# Altium schematic sheet USB_CONNS.SchDoc
size A4; DrawnBy: UGUR KELES; SheetNumber: 4; SheetTotal: 4; Size: A4
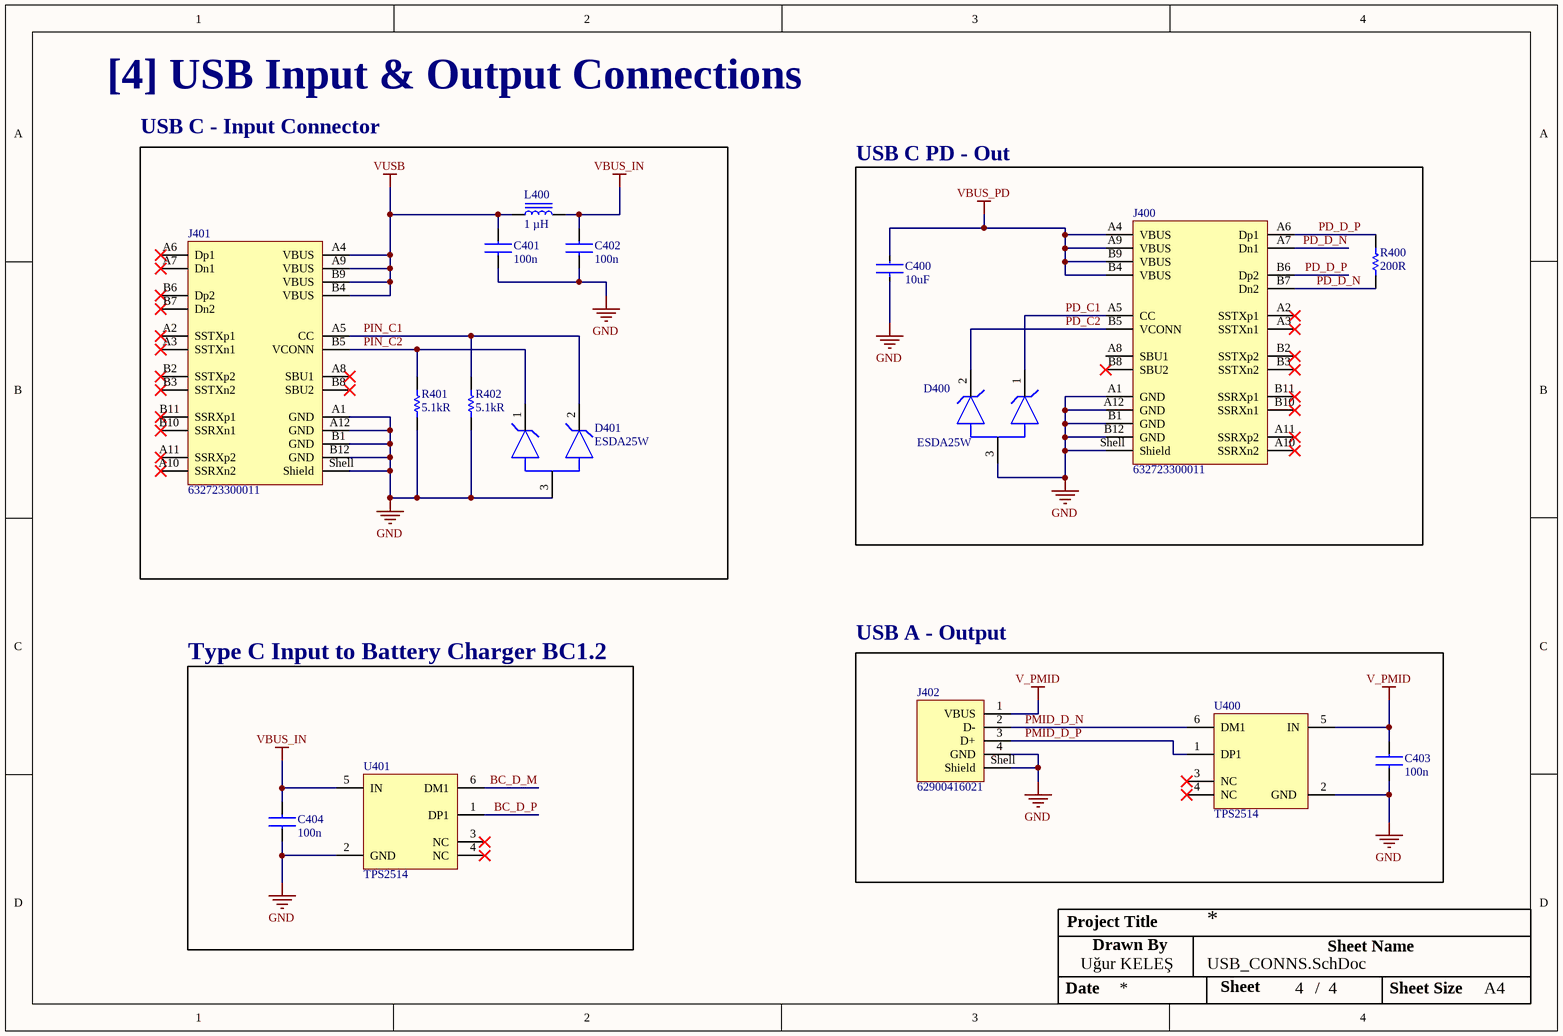
[diagram p0: USB_CONNS.SchDoc]

## Parts
C400  Capacitance: 10uF  [FP-GRT31C-0_2-IPC_A]  (hidden comment: GRT31CR61H106ME01L)
C401  100n  [CAP CER 0402]
C402  100n  [CAP CER 0402]
C403  100n  [CAP CER 0402]
C404  100n  [CAP CER 0402]
D400  ESDA25W  [FP-SOT323-3L-IPC_C]
D401  ESDA25W  [FP-SOT323-3L-IPC_C]
J400  632723300011  [632723300011]
J401  632723300011  [632723300011]
J402  62900416021  [62900416021]
L400  1 µH  [TDK MLZ1608]
R400  value 200R  [RESC1005X40X25ML05T05]  (hidden comment: CRCW0402200RJNED)
R401  value 5.1kR  [RESC1005X40X25NL05T10]  (hidden comment: RC0402FR-075K1L)
R402  value 5.1kR  [RESC1005X40X25NL05T10]  (hidden comment: RC0402FR-075K1L)
U400  TPS2514  [SOT23-6L]
U401  TPS2514  [SOT23-6L]

## Blocks framed on the sheet
USB C - Input Connector: C401 C402 D401 J401 L400 R401 R402
USB C PD - Out: C400 D400 J400 R400
Type C Input to Battery Charger BC1.2: C404 U401
USB A - Output: C403 J402 U400

## Nets
GND: C400.1 C401.1 C402.1 C403.1 C404.1 D400.3(COMMON_ANODE) D401.3(COMMON_ANODE) J400.A1(GND) J400.A12(GND) J400.B1(GND) J400.B12(GND) J400.Shell(Shield) J401.A1(GND) J401.A12(GND) J401.B1(GND) J401.B12(GND) J401.Shell(Shield) J402.4(GND) J402.Shell(Shield) R401.2 R402.2 U400.2(GND) U401.2(GND)
V_PMID: C403.2 J402.1(VBUS) U400.5(IN)
VBUS_IN: C402.2 C404.2 L400.2 U401.5(IN)
VBUS_PD: C400.2 J400.A4(VBUS) J400.A9(VBUS) J400.B4(VBUS) J400.B9(VBUS)
VUSB: C401.2 J401.A4(VBUS) J401.A9(VBUS) J401.B4(VBUS) J401.B9(VBUS) L400.1
BC_D_M: U401.6(DM1)
BC_D_P: U401.1(DP1)
PD_C1: D400.1(1_CATHODE) J400.A5(CC)
PD_C2: D400.2(2_CATHODE) J400.B5(VCONN)
PD_D_N: J400.A7(Dn1) J400.B7(Dn2) R400.1
PD_D_P: J400.A6(Dp1) J400.B6(Dp2) R400.2
PIN_C1: D401.2(2_CATHODE) J401.A5(CC) R402.1
PIN_C2: D401.1(1_CATHODE) J401.B5(VCONN) R401.1
PMID_D_N: J402.2(D-) U400.6(DM1)
PMID_D_P: J402.3(D+) U400.1(DP1)

Not connected (* = marked no-connect by the designer): J400 A2(SSTXp1)* A3(SSTXn1)* A8(SBU1) A10(SSRXn2)* A11(SSRXp2)* B2(SSTXp2)* B3(SSTXn2)* B8(SBU2)* B10(SSRXn1)* B11(SSRXp1)*; J401 A2(SSTXp1)* A3(SSTXn1)* A6(Dp1)* A7(Dn1)* A8(SBU1)* A10(SSRXn2)* A11(SSRXp2)* B2(SSTXp2)* B3(SSTXn2)* B6(Dp2)* B7(Dn2)* B8(SBU2)* B10(SSRXn1)* B11(SSRXp1)*; U400 3(NC)* 4(NC)*; U401 3(NC)* 4(NC)*

## Notes on the sheet
- [4] USB Input & Output Connections
- Project Title
- Uğur KELEŞ
- Drawn By
- Sheet Name
- Date
- Sheet
- /
- Sheet Size

## Library data of the parts
C400 = CMP-06035-048951-1: CAP CER 10UF 50V X5R 1206; Tolerance: 20%; Length: 0.126inch; Mount: Surface Mount; Packaging: Tape and Reel; Case/Package: 1206; Case Code (Imperial): 1206; Max Operating Temperature: 85°C; Voltage Rating: 50V; Ratings: AEC-Q200; Min Operating Temperature: -55°C; Thickness: 0.071inch; Width: 0.063inch; Case Code (Metric): 3216
C401-C404 = CAP CER GENERIC 0402: Designed by: UK; Value: 100n
D400 D401 = CMP-12225-000065-1: TVS DIODE 24VWM SOT323; Number of Elements: 2; Leakage Current: 1uA; Reverse Standoff Voltage: 24V; ESD Protection: Yes; Operating Supply Voltage: 1.2V; Peak Pulse Power: 400W; Test Current: 1mA; Power Line Protection: No; Breakdown Voltage: 25V; Direction: Unidirectional; Max Breakdown Voltage: 30V; Element Configuration: Common Anode; Diode Type: ZENER; Capacitance: 65pF; Depth: 1.25mm; Number of Channels: 2; Termination: SMD/SMT; Width: 1.25mm; Mount: Surface Mount; Working Voltage: 24V; Number of Pins: 3; RoHS Compliant: Yes; REACH SVHC: No SVHC; Max Power Dissipation: 400W; Number of Unidirectional Channels: 2; Radiation Hardening: No; Height: 1.1mm; Series: ESDA, TRANSIL™; Case/Package: SOT-323; Max Reverse Leakage Current: 1uA; Max Operating Temperature: 125°C; Lead Free: Lead Free; Resistor Type: Zener; Min Operating Temperature: -40°C; Voltage Rating (DC): 25V; Reverse Breakdown Voltage: 25V; Package Quantity: 1; Min Breakdown Voltage: 25V; Polarity: Unidirectional; Packaging: Tape and Reel; Length: 2mm
J400 J401 = CMP-1502-03214-3: NexarPartId: 68112675; Pin Length: 1.9mm; Current Rating: 5A; Gender: Receptacle; Voltage Rating: 20V; Number of Contacts: 24; Insulation Resistance: 1GΩ; USB Standard: USB 3.1; Connector Type: USB; Contact Resistance: 30mΩ; Min Operating Temperature: -40°C; Mount: Surface Mount, Through Hole; Height: 3.21mm; Number of Pins: 24; RoHS: Compliant; Orientation: Horizontal; Max Operating Temperature: 105°C; Packaging: Tape and Reel; Contact Material: Gold, Nickel
J402 = CMP-1502-03240-2: NexarPartId: 19991170; Number of Contacts: 4; Insulation Resistance: 1GΩ; Connector Type: USB; Contact Resistance: 20mΩ; Gender: Receptacle; Current Rating: 1.5A; Operating Supply Voltage: 30V; USB Standard: USB 2.0; Packaging: Cut Tape; Contact Plating: Gold; REACH SVHC: Unknown; Orientation: Horizontal; RoHS: Compliant; Features: Shielded; Length: 14.4mm; Max Operating Temperature: 105°C; Number of Pins: 4; Termination: SMD/SMT; Lead Free: Lead Free; Min Operating Temperature: -40°C; Mount: Horizontal, Surface Mount
L400 = MLZ1608N1R0LT000: FIXED IND 1UH 700MA 110 MOHM SMD; Manufacturer: TDK Corporation; Current - Saturation: 140mA; Frequency - Self Resonant: 170MHz; Inductance Frequency - Test: 2 MHz; Material - Core: Ferrite; Shielding: Shielded; Tolerance: ±20%; Type: Multilayer; Part Number: MLZ1608N1R0LT000; ComponentLink1Description: Datasheet; ComponentLink1URL: https://product.tdk.com/info/en/catalog/datasheets/inductor_commercial_decoupling_mlz1608_en.pdf?ref_disty=digikey; ComponentLink2Description: DigiKey Link; ComponentLink2URL: https://www.digikey.com/en/products/detail/tdk-corporation/MLZ1608N1R0LT000/2523491; Current Rating (Amps): 700 mA; DC Resistance (DCR): 110mOhm; Device Package: 0603 (1608 Metric); Height - Seated (Max): 0.037" (0.95mm); Inductance: 1 µH; LastUpdated: 26-Jul-24 2:58:53 PM; Lifecycle Status: Active; Minimum Order: 1; Mounting Type: Surface Mount; Operating Temperature: -55°C ~ 125°C; Package / Case: 0603 (1608 Metric); Packaging: TapeAndReel; PartId: 8203; Part Status: Active; Price: 0.04; Series: MLZ; Size / Dimension: 0.063" L x 0.031" W (1.60mm x 0.80mm); Supplier 1: DigiKey; Supplier Part Number 1: 445-6753-1-ND; Supplier Device Package: 0603 (1608 Metric); Value: 1 µH
R400 = CMP-2002-08353-1: Manufacturer: Vishay Dale; Tolerance: 5%; Power: 63mW; Working Voltage: 50V; Temperature Coefficient (ppm/Cel): 200; Rated Temperature: 70°C; Package Height: 0.35mm; Package Length: 1mm; Package Width: 0.5mm; Reference Standard: AEC-Q200; Part Number: CRCW0402200RJNED; Supplier: Mouser; Supplier Part Number: 71-CRCW0402J-200-E3; Manufacturer Part Number: CRCW0402200RJNED; RoHS: Yes; Category: Chip SMD Resistors; Stock: 16278; Pricing: 1=0,1, 10=0,018, 50=0,018, 100=0,014, 1000=0,008, 10000=0,004 (USD); Mounting Technology: Surface Mount; Pins: 2; Case/Package: 0402; Terminal Finish: Nickel; Package Shape: Rectangular; Min Operating Temperature: -55°C; Max Operating Temperature: 155°C; JESD-609 Code: e3; Resistor Type: FIXED RESISTOR; Construction: Chip; Packaging: Tape and Reel; Technology: METAL GLAZE/THICK FILM; Termination: Wraparound; Reach SVHC Compliant: Yes; RoHS Compliant: Yes; ComponentLink1URL: https://datasheet.ciiva.com:443/pdfs/VipMasterIC/IC/VISH/VISH-S-A0007266705/VISH-S-A0007266705-1.pdf?src-supplier=IHS+Markit; ComponentLink1Description: https://datasheet.ciiva.com:443/pdfs/VipMasterIC/IC/VISH/VISH-S-A0007266705/VISH-S-A0007266705-1.pdf?src-supplier=IHS+Markit; ComponentLink2URL: https://datasheet.ciiva.com/3883/41394838s8306212n6892-3883398.pdf?src-supplier=Arrow+Electronics; ComponentLink2Description: https://datasheet.ciiva.com/3883/41394838s8306212n6892-3883398.pdf?src-supplier=Arrow+Electronics; ComponentLink3URL: https://datasheet.ciiva.com/26914/getdatasheetpartid-123864-26914679.pdf?src-supplier=Verical; ComponentLink3Description: https://datasheet.ciiva.com/26914/getdatasheetpartid-123864-26914679.pdf?src-supplier=Verical; ComponentLink4URL: https://datasheet.ciiva.com/28634/1847332-28634488.pdf?src-supplier=Element14; ComponentLink4Description: https://datasheet.ciiva.com/28634/1847332-28634488.pdf?src-supplier=Element14; ComponentLink5URL: https://datasheet.ciiva.com/46385/1807946-46385293.pdf?src-supplier=Element14; ComponentLink5Description: https://datasheet.ciiva.com/46385/1807946-46385293.pdf?src-supplier=Element14; ComponentLink6URL: https://datasheet.ciiva.com/2462/dcrcwe3-2462074.pdf?src-supplier=Digikey; ComponentLink6Description: https://datasheet.ciiva.com/2462/dcrcwe3-2462074.pdf?src-supplier=Digikey; ComponentLink7URL: https://datasheet.ciiva.com/2462/dcrcwe3-2462075.pdf?src-supplier=Digikey; ComponentLink7Description: https://datasheet.ciiva.com/2462/dcrcwe3-2462075.pdf?src-supplier=Digikey; ComponentLink8URL: https://datasheet.ciiva.com/2462/dcrcwe3-2462073.pdf?src-supplier=Digikey; ComponentLink8Description: https://datasheet.ciiva.com/2462/dcrcwe3-2462073.pdf?src-supplier=Digikey; ComponentLink9URL: https://datasheet.ciiva.com/16759/70201119-16759061.pdf?src-supplier=Allied+Electronics; ComponentLink9Description: https://datasheet.ciiva.com/16759/70201119-16759061.pdf?src-supplier=Allied+Electronics; ComponentLink10URL: https://datasheet.ciiva.com/22869/70201119-22869423.pdf?src-supplier=Allied+Electronics; ComponentLink10Description: https://datasheet.ciiva.com/22869/70201119-22869423.pdf?src-supplier=Allied+Electronics; ComponentLink11URL: https://datasheet.ciiva.com/8336/dcrcwe3-8336649.pdf?src-supplier=Avnet; ComponentLink11Description: https://datasheet.ciiva.com/8336/dcrcwe3-8336649.pdf?src-supplier=Avnet; ComponentLink12URL: https://datasheet.ciiva.com/16394/dcrcwe3-16394457.pdf?src-supplier=Future+Electronics; ComponentLink12Description: https://datasheet.ciiva.com/16394/dcrcwe3-16394457.pdf?src-supplier=Future+Electronics
R401 R402 = CMP-2002-07753-1: Manufacturer: Yageo / Phycomp; Tolerance: 1%; Power: 62.5mW; Rated Temperature: 70°C; Working Voltage: 50V; Temperature Coefficient (ppm/Cel): 100; Additional Feature: LASER TRIMMABLE; Package Height: 0.35mm; Package Length: 1mm; Package Width: 0.5mm; Part Number: RC0402FR-075K1L; Supplier: Mouser; Supplier Part Number: 603-RC0402FR-075K1L; Manufacturer Part Number: RC0402FR-075K1L; RoHS: Yes; Category: Chip SMD Resistors; Stock: 364914; Pricing: 1=0,1, 10=0,008, 50=0,008, 100=0,005, 1000=0,004, 10000=0,002 (USD); Mounting Technology: Surface Mount; Pins: 2; Package Shape: Rectangular; Case/Package: 0402; Terminal Finish: Nickel; Min Operating Temperature: -55°C; Max Operating Temperature: 155°C; JESD-609 Code: e3; Resistor Type: FIXED RESISTOR; Construction: Chip; Technology: METAL GLAZE/THICK FILM; Termination: Wraparound; Packaging: Tape and Reel; Reach SVHC Compliant: Yes; RoHS Compliant: Yes; ComponentLink1URL: https://datasheet.ciiva.com:443/pdfs/VipMasterIC/IC/YAGO/YAGO-S-A0008145938/YAGO-S-A0008145938-1.pdf?src-supplier=IHS+Markit; ComponentLink1Description: https://datasheet.ciiva.com:443/pdfs/VipMasterIC/IC/YAGO/YAGO-S-A0008145938/YAGO-S-A0008145938-1.pdf?src-supplier=IHS+Markit
U400 U401 = TPS2514: Power Supply Support Circuit, Fixed, 1 Channel, PDSO6; Manufacturer: Texas Instruments; Manufacturer Part Number: TPS2514DBVR; Package Body Material: Plastic; Adjustable Threshold: No; Number of Channels: 1; Package Equivalence Code: TSOP6,.11,37; Max Supply Voltage: 5.5V; Min Supply Voltage: 4.5V; Nominal Supply Voltage: 5V; Supply Current-Max (Isup): 200uA; Qualification Status: Not Qualified; Designed by: UK; Supplier: Mouser; Supplier Part Number: 595-TPS2514DBVR; RoHS: Yes; Category: Power Management ICs; Stock: 6553; Pricing: 1=1,24, 10=0,817, 50=0,817, 100=0,678, 1000=0,624, 10000=0,516 (USD); Case/Package: LSSOP; Pins: 6; Package Shape: Rectangular; Terminal Finish: Nickel; Min Operating Temperature: -40°C; Max Operating Temperature: 125°C; JESD-609 Code: e4; Throw Configuration: POWER SUPPLY SUPPORT CIRCUIT; JESD-30 Code: R-PDSO-G6; Moisture Sensitivity Level: 1; Channels: 1; Package Style: SMALL OUTLINE, LOW PROFILE, SHRINK PITCHMeter; Surface Mount: Yes; Terminal Form: Gull Wing; Terminal Position: DUAL; Peak Reflow Temperature (Cel): 260°C; Power Supplies: 5V; Length: 2.9mm; Width: 1.6mm; Height - Seated (Max): 1.45mm; Terminal Pitch: 0.95mm; Temperature Grade: AUTOMOTIVE; Reach SVHC Compliant: Yes; RoHS Compliant: Yes; ComponentLink1URL: https://www.ti.com:443/lit/ds/symlink/tps2513.pdf?src-supplier=IHS+Markit; ComponentLink1Description: https://www.ti.com:443/lit/ds/symlink/tps2513.pdf?src-supplier=IHS+Markit; ComponentLink2URL: https://datasheet.ciiva.com/18567/tps2514-18567492.pdf?src-supplier=Digikey; ComponentLink2Description: https://datasheet.ciiva.com/18567/tps2514-18567492.pdf?src-supplier=Digikey; ComponentLink3URL: https://datasheet.ciiva.com/26909/getdatasheetpartid-740963-26909228.pdf?src-supplier=Verical; ComponentLink3Description: https://datasheet.ciiva.com/26909/getdatasheetpartid-740963-26909228.pdf?src-supplier=Verical; ComponentLink4URL: https://datasheet.ciiva.com/29899/tps2514-29899084.pdf?src-supplier=Avnet; ComponentLink4Description: https://datasheet.ciiva.com/29899/tps2514-29899084.pdf?src-supplier=Avnet